# Altium schematic sheet power_supply.SchDoc
size A; SheetNumber: 1; SheetTotal: 1
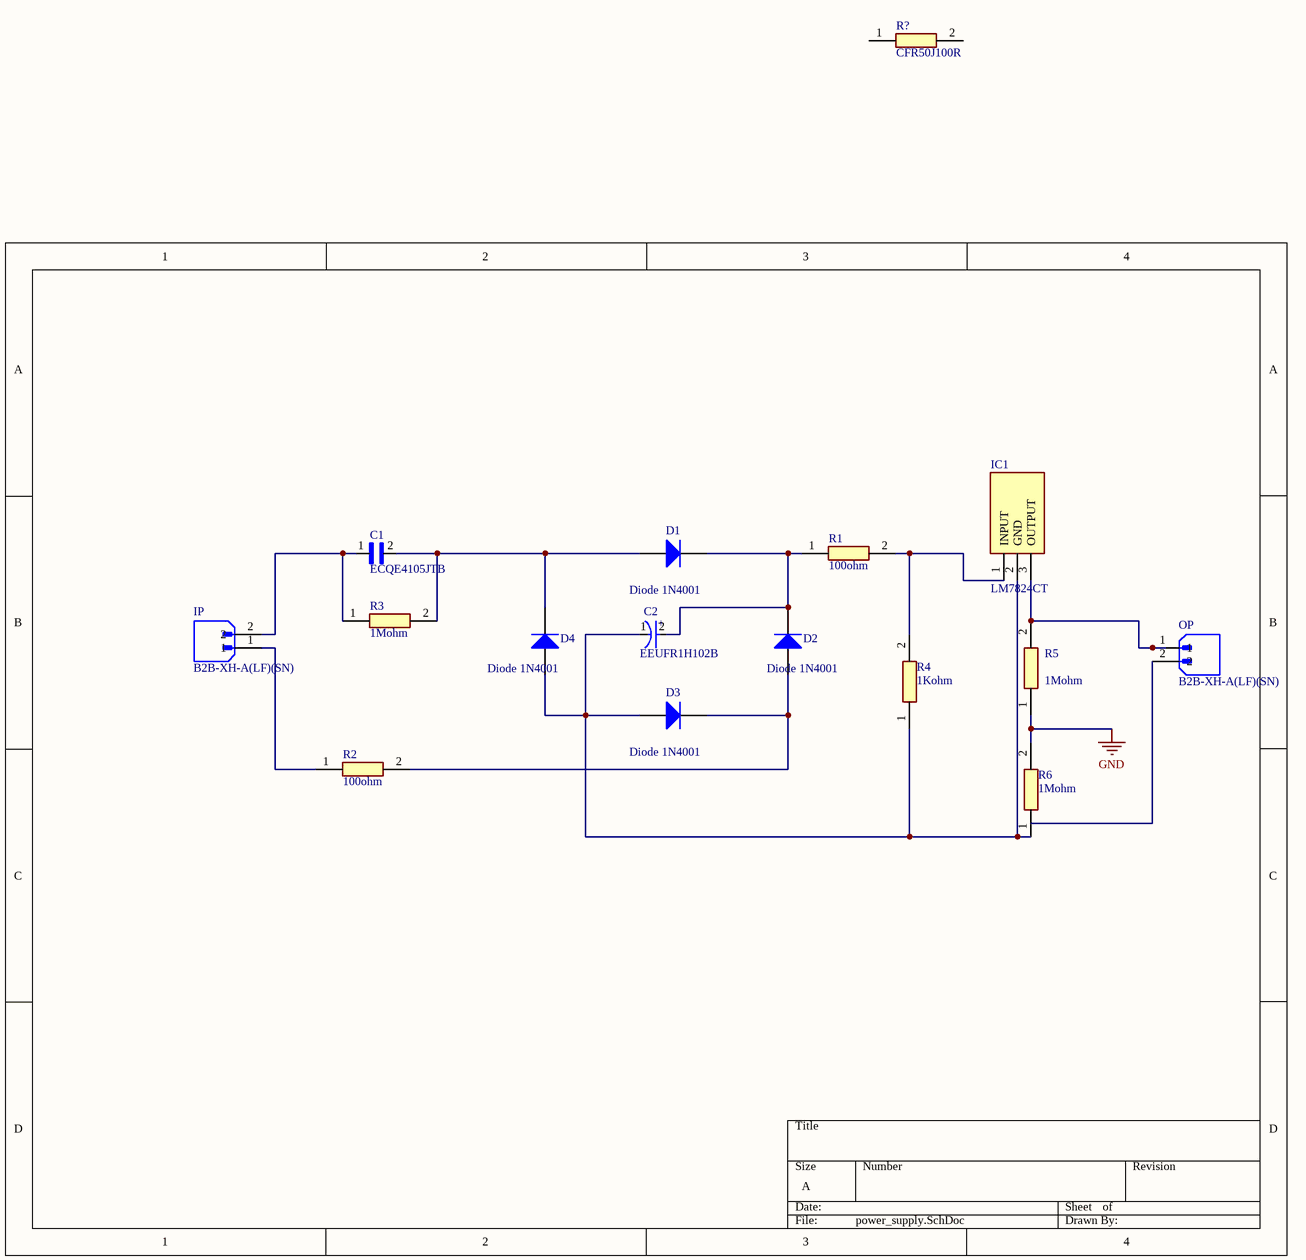
[diagram p0: power_supply.SchDoc]

## Parts
C1  ECQE4105JTB  [CAPRR1500W80L2650T850H2300]
C2  EEUFR1H102B  [FP-RAD-TH-D_16_0_5-L_25_2-MFG]
D1  Diode 1N4001  [DO-41]
D2  Diode 1N4001  [DO-41]
D3  Diode 1N4001  [DO-41]
D4  Diode 1N4001  [DO-41]
IC1  LM7824CT  [TO254P470X1028X1955-3P]
IP  B2B-XH-A(LF)(SN)  [JST_B2B-XH-A(LF)(SN)]
OP  B2B-XH-A(LF)(SN)  [JST_B2B-XH-A(LF)(SN)]
R1  100ohm  [RESAD2100W59L900D300]
R2  100ohm  [RESAD2100W59L900D300]
R3  1Mohm  [RESAD2460W60L900D390]
R4  1Kohm  [RESAD3800W75L1600D550]
R5  1Mohm  [RESAD2460W60L900D390]
R6  1Mohm  [RESAD2460W60L900D390]
R?  CFR50J100R  [RESAD2100W59L900D300]

## Nets
GND: R5.1 R6.2
NetC1_1: C1.1 IP.2 R3.1
NetC1_2: C1.2 D1.1(A) D4.2(K) R3.2
NetC2_1: C2.1(C) D3.1(A) D4.1(A) IC1.2(GND) R4.1 R6.1
NetC2_2: C2.2(A) D1.2(K) D2.2(K) R1.1
NetD2_1: D2.1(A) D3.2(K) R2.2
NetIC1_1: IC1.1(INPUT) R1.2 R4.2
NetIC1_3: IC1.3(OUTPUT) OP.1 R5.2
NetIP_1: IP.1 R2.1

Not connected (* = marked no-connect by the designer): OP 2; R? 1 2

## Notes on the sheet
- (in symbol CMP-05427-000487-1) +

## Library data of the parts
C2 = CMP-05427-000487-1: Aluminum Electrolytic Capacitors (Radial Lead Type) 1000uF ±20% 50V; Ripple Current: 3.32A; Impedance: 16mR; Polarity: Polar; Life (Hours): 10000Hour; Capacitance: 1mF; Lead Diameter: 0.8mm; Mount: Through Hole; Series: FR; Package Quantity: 250; Length: 25mm; Radiation Hardening: No; REACH SVHC: No SVHC; Case/Package: Radial; Height: 25mm; Min Operating Temperature: -40°C; Contact Plating: Tin; Lead Free: Lead Free; Height - Seated (Max): 0.984inch; RoHS Compliant: Yes; Features: General Purpose; ESR (Equivalent Series Resistance): 16mR; Voltage Rating: 50V; Diameter: 16mm; Voltage Rating (DC): 50V; Max Operating Temperature: 105°C; Lead Pitch: 7.5mm; Packaging: Tape and Reel; Number of Pins: 2; Tolerance: 20%; Termination: Through Hole
D1-D4 = Diode 1N4001: 1 Amp General Purpose Rectifier; Published: 8-Jun-2000; LatestRevisionDate: 17-Jul-2002; LatestRevisionNote: Re-released for DXP Platform.; DatasheetVersion: 1998; PackageVersion: Aug-1999; PackageReference: DO-41; Publisher: Altium Limited; PackageDescription: Diode, Axial; Body 5.2 x 2.7 mm (LxDia. max), Lead Dia. 0.86 mm (max); Code_JEDEC: DO-204-AL; ComponentLink1Description: Manufacturer Link; ComponentLink1URL: http://www.fairchildsemi.com/; ComponentLink2Description: Datasheet; ComponentLink2URL: http://www.fairchildsemi.com/ds/1N%2F1N4001.pdf
IC1 = LM7824CT: Integrated Circuit; Manufacturer_Name: Texas Instruments; Datasheet Link: https://media.digikey.com/pdf/Data%20Sheets/National%20Semiconductor%20PDFs/LM140,LM340(A).LM7800C.pdf; Height: 4.7mm; Manufacturer_Part_Number: LM7824CT; Mouser Part Number: N/A; Mouser Price/Stock: https://www.mouser.co.uk/ProductDetail/Texas-Instruments/LM7824CT?qs=9V2QonpqdTsSUSVcEBRo9w%3D%3D
IP OP = B2B-XH-A(LF)(SN): Connector Header Through Hole 2 position 0.098 (2.50mm); MF: JST Sales; SnapEDA_Link: https://www.snapeda.com/parts/B2B-XH-A(LF)(SN)/JST+Sales+America+Inc./view-part/?ref=snap; Package: None; Value: *; MP: B2B-XH-A(LF)(SN); Check_prices: https://www.snapeda.com/parts/B2B-XH-A(LF)(SN)/JST+Sales+America+Inc./view-part/?ref=eda
R1 R2 R? = CFR50J100R: Resistor; Manufacturer_Name: TE Connectivity; Datasheet Link: https://componentsearchengine.com/Datasheets/1/CFR50J100R.pdf; Manufacturer_Part_Number: CFR50J100R; Mouser Part Number: 279-CFR50J100R; Mouser Price/Stock: https://www.mouser.co.uk/ProductDetail/TE-Connectivity-Holsworthy/CFR50J100R?qs=DDevMFOh4stqAwq6Act%2Fuw%3D%3D
R3 R5 R6 = FMP200JR-52-1M: Resistor; Manufacturer_Name: KEMET; Datasheet Link: https://www.arrow.com/en/products/fmp200jr-52-1m/yageo; Manufacturer_Part_Number: FMP200JR-52-1M; Mouser Part Number: 603-FMP200JR-52-1M; Mouser Price/Stock: https://www.mouser.co.uk/ProductDetail/Yageo/FMP200JR-52-1M/?qs=EiYF7fRZytxLUrXUvoK13w%3D%3D; Arrow Part Number: FMP200JR-52-1M; Arrow Price/Stock: https://www.arrow.com/en/products/fmp200jr-52-1m/yageo
R4 = CFR200J1K0: Resistor; Manufacturer_Name: TE Connectivity; Datasheet Link: https://altium.componentsearchengine.com/Datasheets/2/CFR200J1K0.pdf; Manufacturer_Part_Number: CFR200J1K0; Mouser Part Number: 279-CFR200J1K0; Mouser Price/Stock: https://www.mouser.com/Search/Refine.aspx?Keyword=279-CFR200J1K0; Arrow Part Number: CFR200J1K0; Arrow Price/Stock: https://www.arrow.com/en/products/cfr200j1k0/te-connectivity
C1 = ECQE4105JTB: MP: ECQE4105JTB; Value: *; Price: None; Package: None; Availability: Unavailable